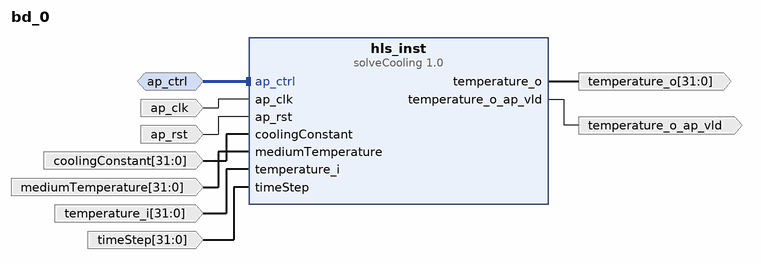
[diagram p0: block diagram of the top level]
# Vivado block design bd_0, xc7a200tsbv484-1, Vivado 2023.2.2
create_bd_design bd_0

create_bd_intf_port -mode Slave -vlnv xilinx.com:interface:acc_handshake_rtl:1.0 ap_ctrl
create_bd_port -dir I -type clk ap_clk
set_property -dict {CONFIG.FREQ_HZ 100000000.0} [get_bd_ports ap_clk]
create_bd_port -dir I -type rst ap_rst
set_property -dict {CONFIG.POLARITY ACTIVE_HIGH} [get_bd_ports ap_rst]
create_bd_port -dir I -from 31 -to 0 -type data coolingConstant
create_bd_port -dir I -from 31 -to 0 -type data mediumTemperature
create_bd_port -dir I -from 31 -to 0 -type data temperature_i
create_bd_port -dir O -from 31 -to 0 -type data temperature_o
create_bd_port -dir O temperature_o_ap_vld
create_bd_port -dir I -from 31 -to 0 -type data timeStep

create_bd_cell -type ip -vlnv xilinx.com:hls:solveCooling:1.0 hls_inst

# ---- connections ----

connect_bd_intf_net -intf_net ap_ctrl_0_1 [get_bd_intf_ports ap_ctrl] [get_bd_intf_pins hls_inst/ap_ctrl]
connect_bd_net -net ap_clk_0_1 [get_bd_ports ap_clk] [get_bd_pins hls_inst/ap_clk]
connect_bd_net -net ap_rst_0_1 [get_bd_ports ap_rst] [get_bd_pins hls_inst/ap_rst]
connect_bd_net -net coolingConstant_0_1 [get_bd_ports coolingConstant] [get_bd_pins hls_inst/coolingConstant]
connect_bd_net [get_bd_pins hls_inst/temperature_o] [get_bd_ports temperature_o]
connect_bd_net [get_bd_pins hls_inst/temperature_o_ap_vld] [get_bd_ports temperature_o_ap_vld]
connect_bd_net -net mediumTemperature_0_1 [get_bd_ports mediumTemperature] [get_bd_pins hls_inst/mediumTemperature]
connect_bd_net -net temperature_i_0_1 [get_bd_ports temperature_i] [get_bd_pins hls_inst/temperature_i]
connect_bd_net -net timeStep_0_1 [get_bd_ports timeStep] [get_bd_pins hls_inst/timeStep]

validate_bd_design
save_bd_design
